# EAGLE design H09R0 (EAGLE 9.6.1)

## Sheet 1 of 2
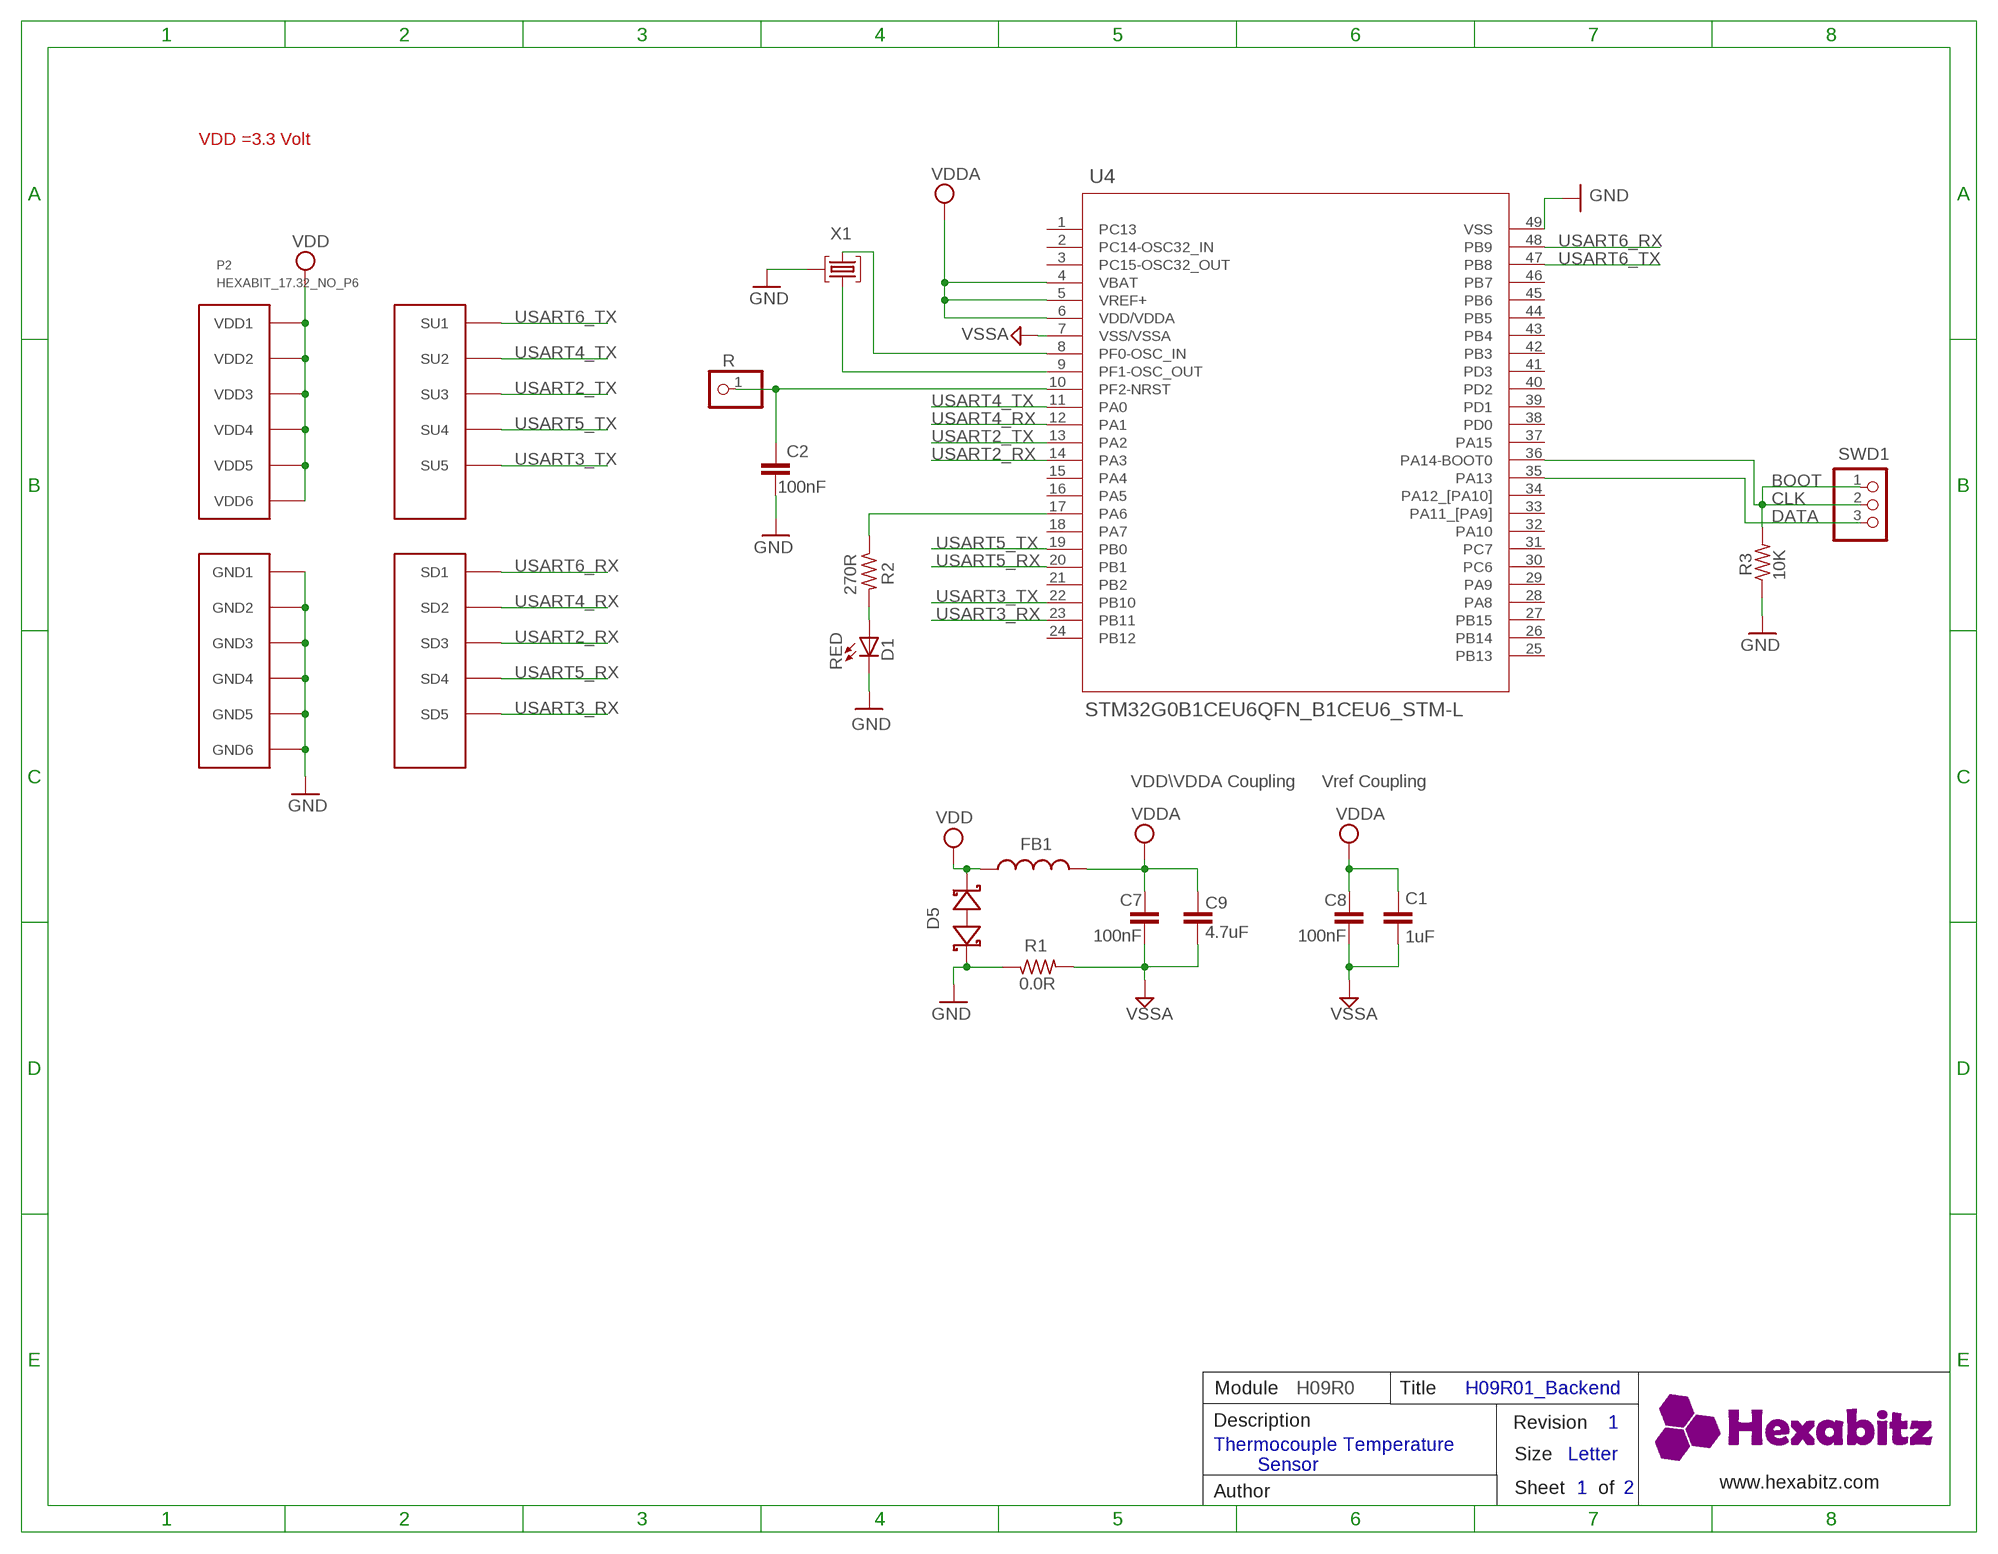
[diagram p0: schematic, sheet 1]

### Parts
C1  1uF  C-0805  [C-0805]
C2  100nF  C-0603  [C-0603]
C7  100nF  C-0603  [C-0603]
C8  100nF  C-0603  [C-0603]
C9  4.7uF  C-0805  [C-0805]
D1  RED  VLMS1300-GS08  [VLMS1300-GS08]
D5  BOURNS_CDSOD323-T03SCBOURNS_CDSOD323-T03SC_0_0  [BOURNS_CDSOD323-T03SC_0]
FB1  FB-TDK_MMZ1608Y300B  FB-0603  [FB-0603]
P2  HEXABIT_17.32_NO_P6  [HEXABIT_17.32_NO_P6]
R  R  PINHD-1X1  [1X01]
R1  0.0R  R-0603  [R-0603]
R2  270R  R-0603  [R-0603]
R3  10K  R-0603  [R-0603]
SWD1  PINHD-1X3  [1X03]
U4  STM32G0B1CEU6QFN_B1CEU6_STM-L  [QFN_B1CEU6_STM-L]
X1  XTALL_CSTCE8M00G52  [XTALL_CSTCE8M00G52]

### Nets
CLK: R3.2 SWD1.1 SWD1.2 U4.36(PA14-BOOT0)
DATA: SWD1.3 U4.35(PA13)
GND: C2.2 D1.C D5.1(A) P2.PAD_PD7(GND1) P2.PAD_PD8(GND2) P2.PAD_PD9(GND3) P2.PAD_PD10(GND4) P2.PAD_PD11(GND5) P2.PAD_PD12(GND6) R1.1 R3.1 U4.49(VSS) X1.P$2 ; also sheet 2
N$8: U4.9(PF1-OSC_OUT) X1.P$1
N$10: U4.8(PF0-OSC_IN) X1.P$3
N$14: C2.1 R.1 U4.10(PF2-NRST)
N$15: R2.1 U4.17(PA6)
N$16: D1.A R2.2
USART2_RX: P2.PAD_PD3(SD3) U4.14(PA3)
USART2_TX: P2.PAD_PU3(SU3) U4.13(PA2)
USART3_RX: P2.PAD_PD5(SD5) U4.23(PB11)
USART3_TX: P2.PAD_PU5(SU5) U4.22(PB10)
USART4_RX: P2.PAD_PD2(SD2) U4.12(PA1)
USART4_TX: P2.PAD_PU2(SU2) U4.11(PA0)
USART5_RX: P2.PAD_PD4(SD4) U4.20(PB1)
USART5_TX: P2.PAD_PU4(SU4) U4.19(PB0)
USART6_RX: P2.PAD_PD1(SD1) U4.48(PB9)
USART6_TX: P2.PAD_PU1(SU1) U4.47(PB8)
VDD: D5.2(C) FB1.2 P2.PAD_PU7(VDD1) P2.PAD_PU8(VDD2) P2.PAD_PU9(VDD3) P2.PAD_PU10(VDD4) P2.PAD_PU11(VDD5) P2.PAD_PU12(VDD6) ; also sheet 2
VDDA: C1.1 C7.1 C8.1 C9.1 FB1.1 U4.4(VBAT) U4.5(VREF+) U4.6(VDD/VDDA)
VSSA: C1.2 C7.2 C8.2 C9.2 R1.2 U4.7(VSS/VSSA)
Unconnected: U4.1(PC13) U4.2(PC14-OSC32_IN) U4.3(PC15-OSC32_OUT) U4.15(PA4) U4.16(PA5) U4.18(PA7) U4.21(PB2) U4.24(PB12) U4.25(PB13) U4.26(PB14) U4.27(PB15) U4.28(PA8) U4.29(PA9) U4.30(PC6) U4.31(PC7) U4.32(PA10) U4.33(PA11_[PA9]) U4.34(PA12_[PA10]) U4.37(PA15) U4.38(PD0) U4.39(PD1) U4.40(PD2) U4.41(PD3) U4.42(PB3) U4.43(PB4) U4.44(PB5) U4.45(PB6) U4.46(PB7)

### Notes on the sheet
- VDD =3.3 Volt
- BOOT
- VDD\VDDA Coupling | Vref Coupling
- Module | H09R0 | Title | H09R01_Backend
- Description | Revision | 1
- Size | Letter
- Thermocouple Temperature 
          Sensor
- 2 | www.hexabitz.com
- Author | Sheet      of | 1
- C:/Users/Admin/Desktop/logodraft.bmp
- C:/Users/Admin/Desktop/logodraft.bmp

## Sheet 2 of 2
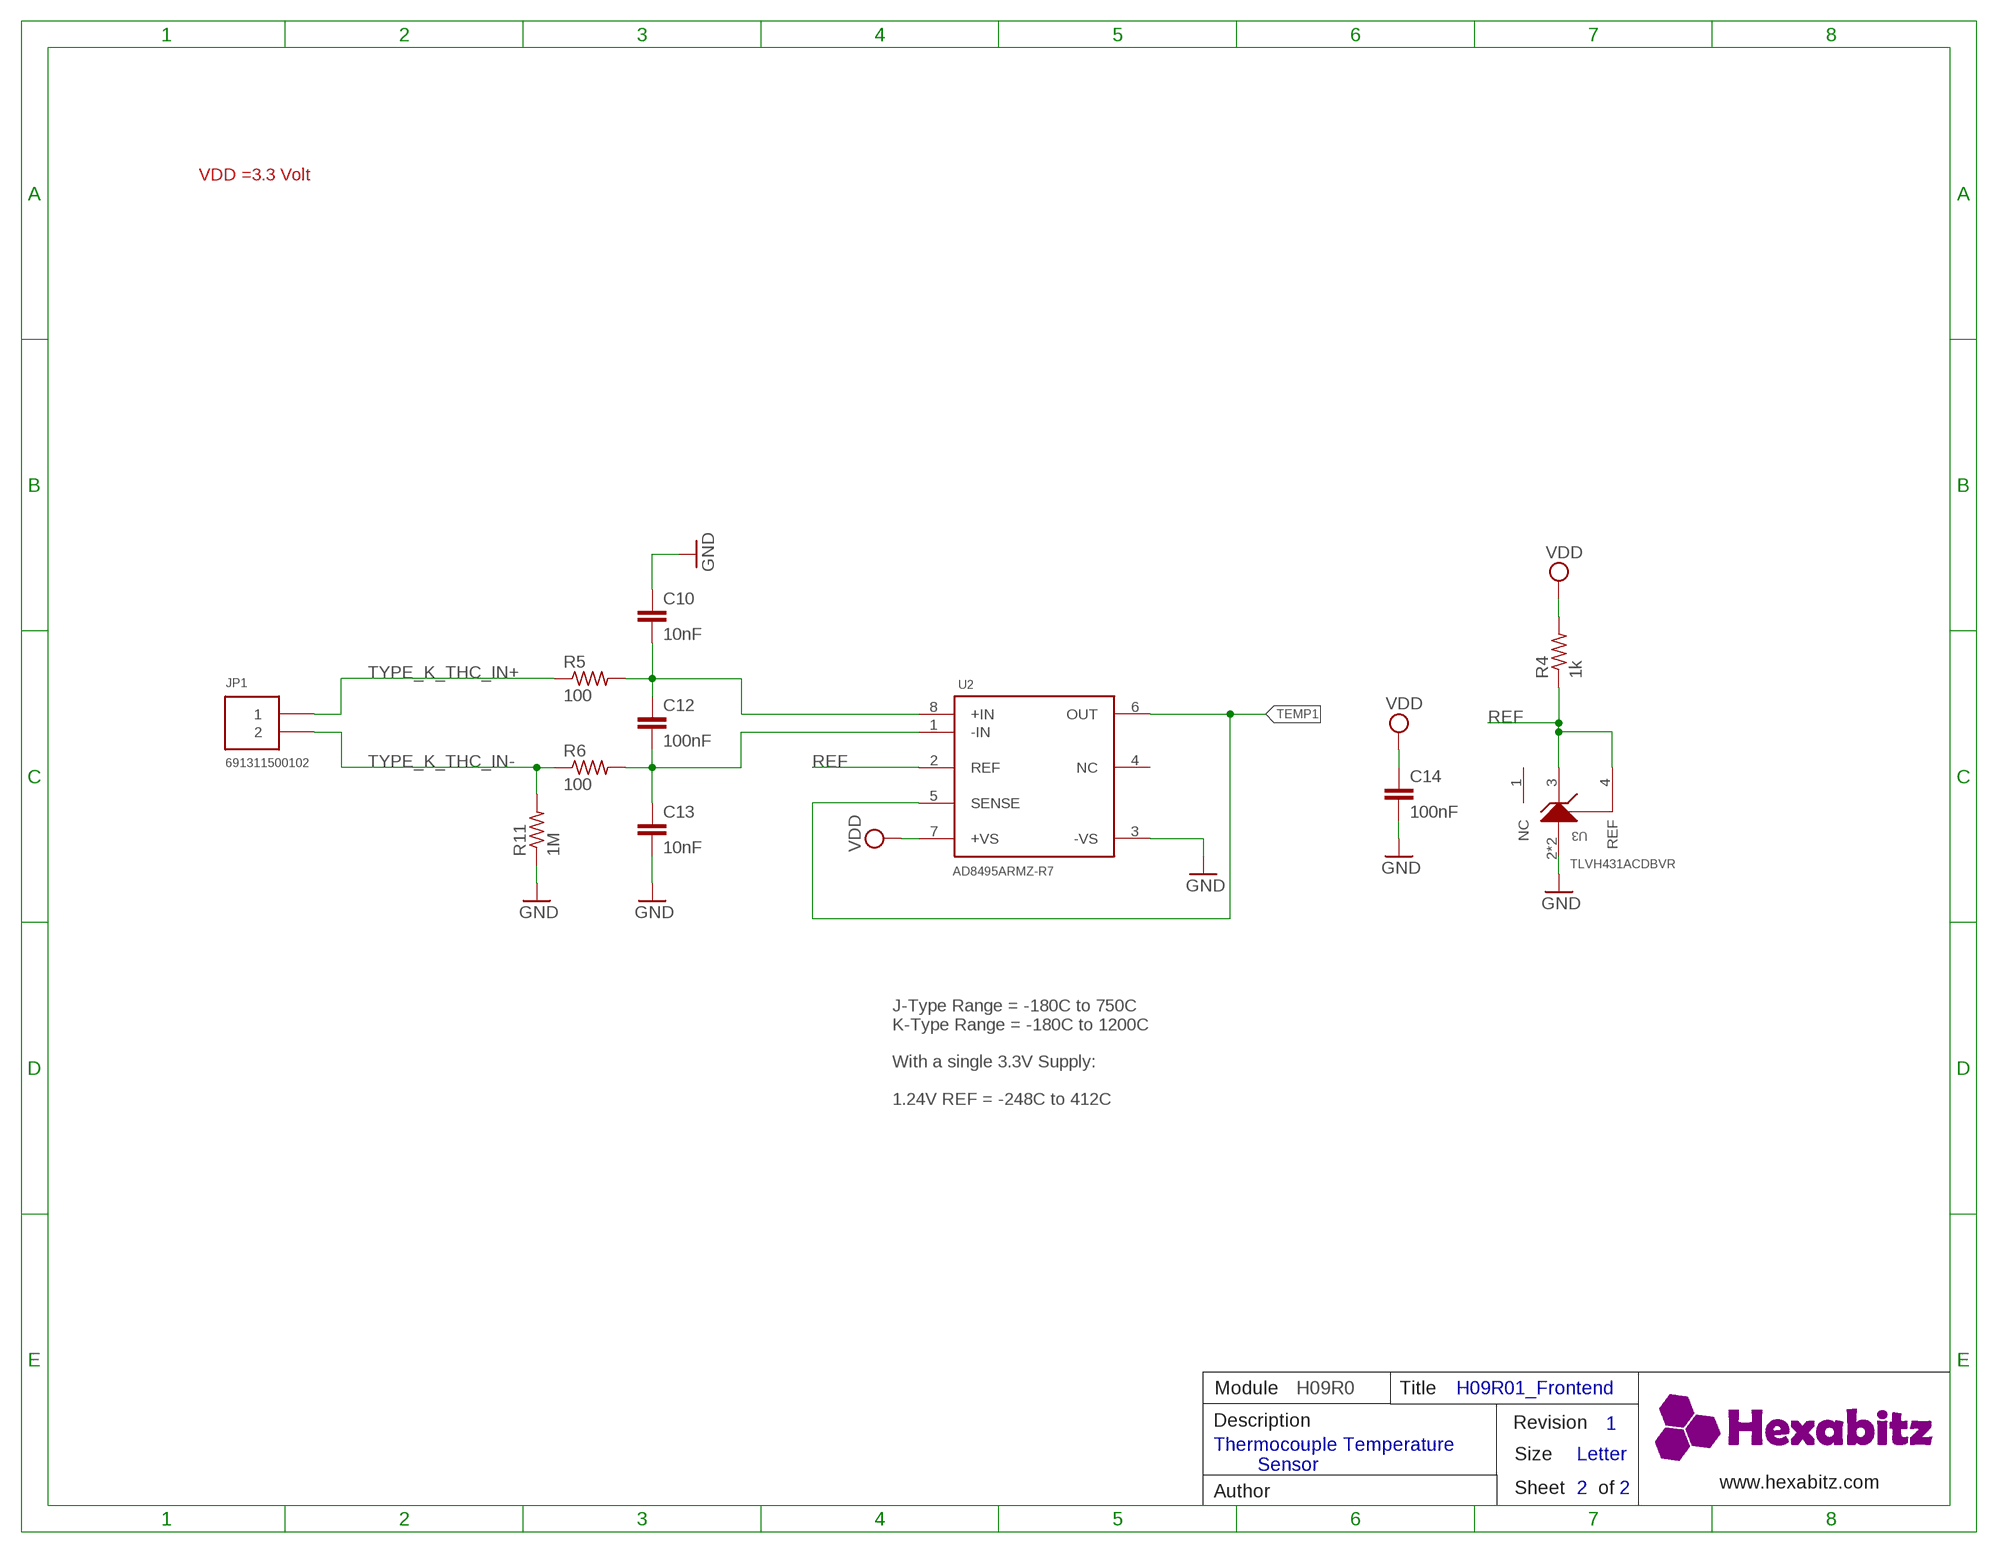
[diagram p1: schematic, sheet 2]

### Parts
C10  10nF  C-0603  [C-0603]
C12  100nF  C-0603  [C-0603]
C13  10nF  C-0603  [C-0603]
C14  100nF  C-0603  [C-0603]
JP1  691311500102  1546111-2  [1546111-2]
R4  1k  R-0402  [R-0402]
R5  100  R-0402  [R-0402]
R6  100  R-0402  [R-0402]
R11  1M  R-0402  [R-0402]
U2  AD8495ARMZ-R7  AD8495ARMZ  [AD8495ARMZ]
U3  TLVH431ACDBVR  [TLVH431ACDBVR]

### Nets
GND: C10.1 C13.2 C14.2 R11.1 U2.3(-VS) U3.2(ANODE) U3.5(ANODE) ; also sheet 1
N$3: C10.2 C12.1 R5.2 U2.8(+IN)
N$7: C12.2 C13.1 R6.2 U2.1(-IN)
REF: R4.1 U2.2(REF) U3.3(CATHODE) U3.4(REF)
TEMP1: U2.5(SENSE) U2.6(OUT)
TYPE_K_THC_IN+: JP1.1 R5.1
TYPE_K_THC_IN-: JP1.2 R6.1 R11.2
VDD: C14.1 R4.2 U2.7(+VS) ; also sheet 1
Unconnected: U2.4(NC) U3.1(NC)

### Notes on the sheet
- VDD =3.3 Volt
- J-Type Range = -180C to 750C
  K-Type Range = -180C to 1200C
  
  With a single 3.3V Supply:
  
  1.24V REF = -248C to 412C
- Module | H09R0 | Title | H09R01_Frontend
- Description | Revision | 1
- Size | Letter
- Thermocouple Temperature 
          Sensor
- www.hexabitz.com
- Author | Sheet      of | 2 | 2
- C:/Users/Admin/Desktop/logodraft.bmp

## Library data of the parts
C1 C9 = HEXABITZ_RCLS:C-0805: CAP CER 10% X7R 0805
C2 C7 C8 = HEXABITZ_RCLS:C-0603: CAP CER 10% X7R 0603
C10 C13 = HEXABITZ_RCLS:C-0603: CAP CER 10% X7R 0603; CAPACITANCE: 10nF; MFN: KEMET; MPN: C0603C103K5RACTU; OCTOPART_URL: https://octopart.com/c0603c103k5ractu-kemet-133094?r=sp&s=R_iPBxLnSmGqhkU2rIMFpg; TOLERANCE: 10%; VOLTAGE_RATING: 50V
C12 C14 = HEXABITZ_RCLS:C-0603: CAP CER 10% X7R 0603; CAPACITANCE: 100nF; MFN: KEMET; MPN: C0603C104K8RACTU; OCTOPART_URL: https://octopart.com/c0603c104k8ractu-kemet-145075?r=sp&s=9bS9ASSwSEqMCE9KBEQZ0g; TOLERANCE: 10%; VOLTAGE_RATING: 10V
D1 = HEXABITZ_USER_INTERFACE_PARTS:VLMS1300-GS08: Red 0603 130° Clear 54 mcd 2 V Surface Mount ChipLED ; Octopart Url : http://octopart.com/vlms1300-gs08-vishay-21709201; MFN: Vishay; MPN: VLMS1300-GS08; OCTOPART_URL: https://octopart.com/vlms1300-gs08-vishay-21709201?r=sp&s=_gcP4_q8T1SC6PJQPTQ9yA
D5 = HEXABITZ_RCLS:BOURNS_CDSOD323-T03SC: CDSOD323-TxxSC - TVS Diode Series; DESCRIPTION: Dio Tvs Vwm 03V 500W Bidir Sod323 / Tape & Reel - 7" Reel; MFN: Bourns; MPN: CDSOD323-T03SC; OCTOPART_URL: https://octopart.com/cdsod323-t03sc-bourns-10487153?r=sp
FB1 = HEXABITZ_RCLS:FB-0603: Ferrite Beads Multi-Layer 0603; MFN: TDK; MPN: MMZ1608Y300B; OCTOPART_URL: https://octopart.com/mmz1608y300b-tdk-368280?r=sp&s=cd9_2ZEqQ9q9UNBuQgHAiA
JP1 = HEXABITZ_CONNECTION_PARTS:1546111-2: Conn Shrouded Header HDR 2 POS 5.08mm Solder ST Thru-Hole; MFN: TE Connectivity; MPN: 1546111-2; OCTOPART_URL: https://octopart.com/1546111-2-te+connectivity-40393355
P2 = hexabitz_connectors:HEXABIT_?_NO_P6: Hexabitz Hexagon Module Connector Hexagon side length = 17.32mm. The following ports are removed: P6
R = HEXABITZ_USER_INTERFACE_PARTS:PINHD-1X1: PIN HEADER; MFN: TE Connectivity; MPN: 87227-1; OCTOPART_URL: https://octopart.com/87227-1-te+connectivity-39512052?r=sp
R1 = HEXABITZ_RCLS:R-0603: Thick Film Resistors - SMD 0603; MFN: Yageo; MPN: RC0603JR-070RL; OCTOPART_URL: https://octopart.com/rc0603jr-070rl-yageo-1241539?r=sp&s=X2NteqRjRNWrnx42Y0aliA; RESISTANCE: 0.0 Ohm
R2 R3 = HEXABITZ_RCLS:R-0603: Thick Film Resistors - SMD 0603
R4 = HEXABITZ_RCLS:R-0402: Thick Film Resistors - SMD 0603; MFN: Yageo; MPN: RC0402FR-071KL; OCTOPART_URL: https://octopart.com/search?q=RC0402FR-071KL&start=0; RESISTANCE: 1k; TOLERANCE: 1%
R5 R6 = HEXABITZ_RCLS:R-0402: Thick Film Resistors - SMD 0603; MFN: Yageo; MPN: RC0402FR-07100RL; OCTOPART_URL: https://octopart.com/search?q=RC0402FR-07100RL&start=0; RESISTANCE: 100; TOLERANCE: 1%
R11 = HEXABITZ_RCLS:R-0402: Thick Film Resistors - SMD 0603; MFN: Yageo; MPN: RC0402FR-071ML; OCTOPART_URL: https://octopart.com/search?q=RC0402FR-071ML&start=0; RESISTANCE: 1M; TOLERANCE: 1%
SWD1 = pinhead:PINHD-1X3: PIN HEADER
U2 = Hexabitz:AD8495ARMZ: Description : IC THERMOCOUPLE A W/COMP 8MSOP; MFG: Analog Devices; MPN: AD8495ARMZ-R7; OCTOPART_URL: https://octopart.com/search?q=AD8495ARMZ-R7&start=0
U3 = Hexabitz:TLVH431ACDBVR: LOW-VOLTAGE ADJUSTABLE PRECISION SHUNT REGULATORS; MFN: Texas Instruments; MPN: TLVH431ACDBVR; OCTOPART_URL: https://octopart.com/search?q=TLVH431ACDBVR&start=0
U4 = HEXABITZ_ICs:STM32G0B1CEU6; COPYRIGHT: Copyright (C) 2021 Ultra Librarian. All rights reserved.; MANUFACTURER_PART_NUMBER: STM32G0B1CEU6; MFR_NAME: STMicroelectronics; SPICEPREFIX: X
X1 = HEXABITZ_RCLS:XTALL_CSTCE8M00G52: MURATA CSTCE8M00G52-R0 RESONATOR, SMD, 8MHZ ; Octopart Url : https://octopart.com/cstce8m00g52-r0-murata-7145559; MFN: Murata; MPN: CSTCE8M00G52Z-R0; OCTOPART_URL: https://octopart.com/cstce8m00g52z-r0-murata-17755941?r=sp&s=JDnNJnrHQhyS8Zk4ofFWXw

## Board
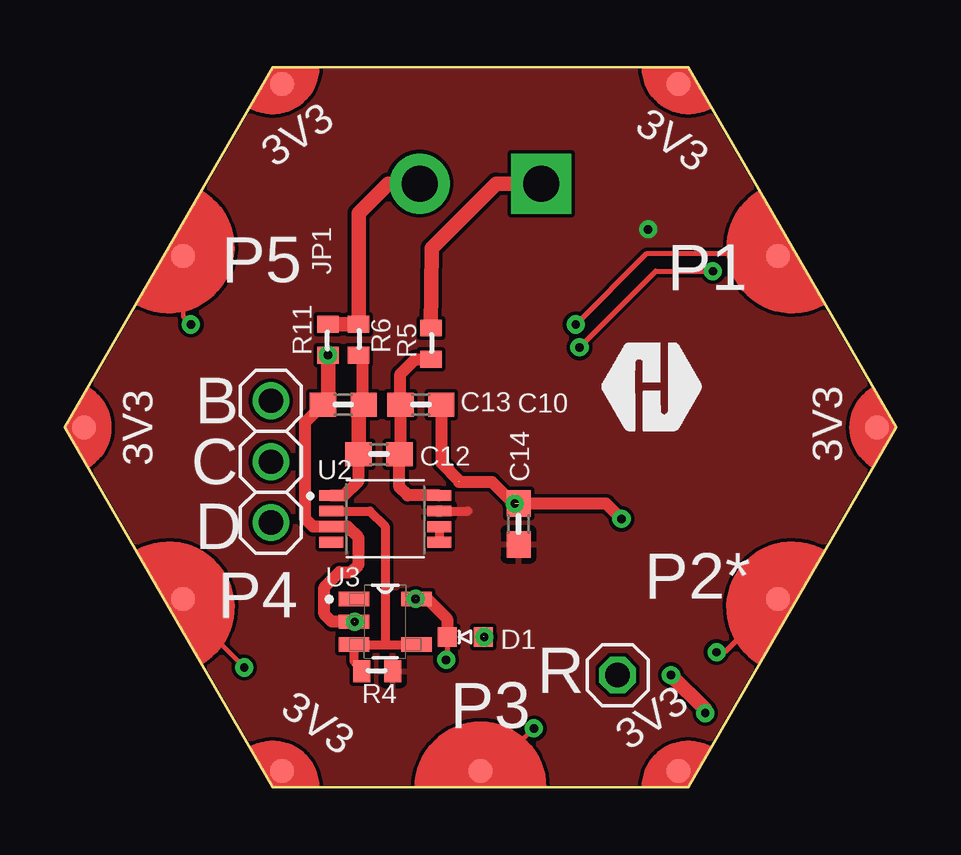
[diagram p2: board, top side]
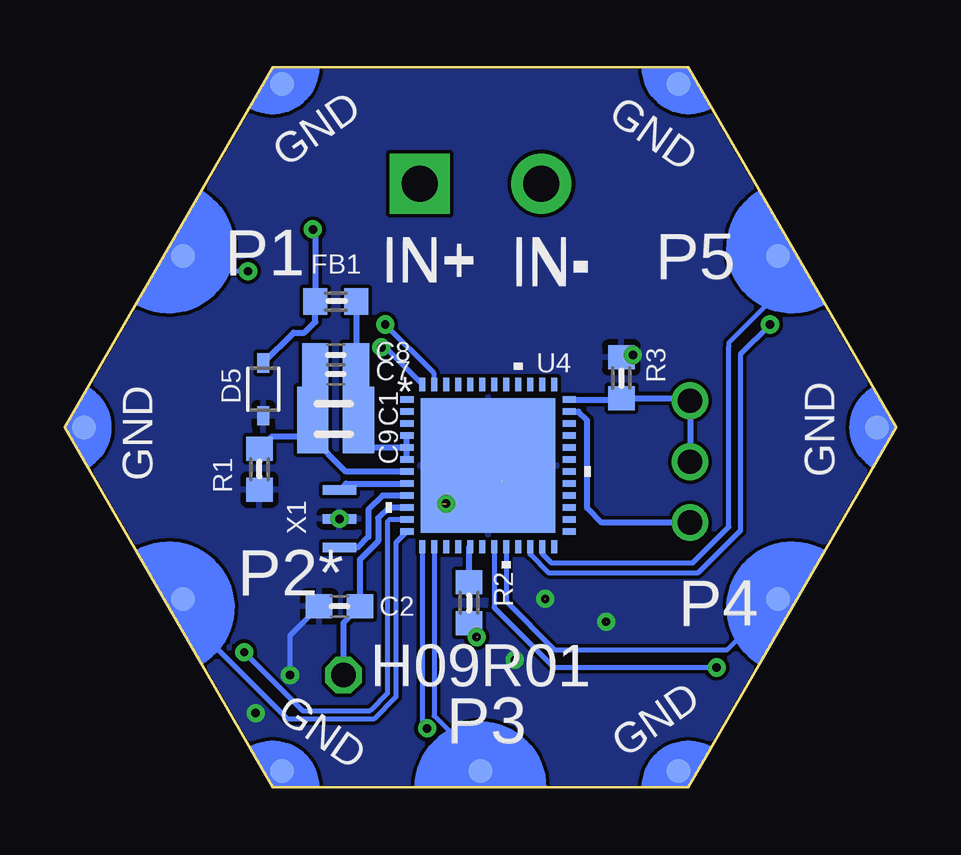
[diagram p3: board, bottom side, seen from below]

Size 34.64 x 30 mm. Coordinates in mm from the lower left corner, seen from the top.
Copper layers (1*16): Top 0.035mm / dielectric 1.5mm / Bottom 0.035mm
Design rules "default *": minimum track width 7mil, minimum drill 10mil, track to track 6mil, track to pad 6mil, pad to pad 6mil, via to via 6mil, smd to smd 0mil, copper to edge 1mil, drill to drill 8mil, minimum pad ring 10mil, minimum via ring 8mil, stop-mask expansion 2mil, vias tented up to drill 15mil, thermal gap 10mil

### Footprints (pad centres in the part's own frame; a part is rotated, then mirrored left to right if it is on the bottom)
C-0805 = smd 1.3 x 1.5: 1 -0.95,0; 2 0.95,0
C-0603 = smd 1.1 x 1: 1 -0.85,0; 2 0.85,0
VLMS1300-GS08 = smd 0.8 x 0.8: A 0,0.75; C 0,-0.75
BOURNS_CDSOD323-T03SC_0 = smd 0.8 x 0.5: 1 -1.1,0; 2 1.1,0
FB-0603 = smd 1 x 1.1: 1 -0.85,0; 2 0.85,0
1546111-2 = drill 1.5 pad 2.5 square: 1 -2.54,0 | drill 1.5 pad 2.5: 2 2.54,0
HEXABIT_17.32_NO_P6 = smd 1 x 1 bottom: PAD_PD1 12.39,7.15; PAD_PD2 12.39,-7.15; PAD_PD3 0,-14.31; PAD_PD4 -12.39,-7.15; PAD_PD5 -12.39,7.15; PAD_PD7 8.26,14.31; PAD_PD8 16.52,0; PAD_PD9 8.26,-14.31; PAD_PD10 -8.26,-14.31; PAD_PD11 -16.52,0; PAD_PD12 -8.26,14.31 | smd 1 x 1: PAD_PU1 12.39,7.15; PAD_PU2 12.39,-7.15; PAD_PU3 0,-14.31; PAD_PU4 -12.39,-7.15; PAD_PU5 -12.39,7.15; PAD_PU7 8.26,14.31; PAD_PU8 16.52,0; PAD_PU9 8.26,-14.31; PAD_PU10 -8.26,-14.31; PAD_PU11 -16.52,0; PAD_PU12 -8.26,14.31
1X01 = drill 1.016 octagon: 1 0,0
R-0603 = smd 1 x 1.1: 1 -0.85,0; 2 0.85,0
R-0402 = smd 0.7 x 0.9: 1 -0.65,0; 2 0.65,0
1X03 = drill 1.016: 1 -2.54,0; 2 0,0; 3 2.54,0
AD8495ARMZ = smd 0.45 x 1: 1 -0.975,-2.244; 2 -0.325,-2.244; 3 0.325,-2.244; 4 0.975,-2.244; 5 0.975,2.244; 6 0.325,2.244; 7 -0.325,2.244; 8 -0.975,2.244
TLVH431ACDBVR = smd 1.27 x 0.6: 1 -1.3,0.95; 2 -1.3,0; 3 -1.3,-0.95; 4 1.3,-0.95; 5 1.3,0.95
QFN_B1CEU6_STM-L = smd 0.55 x 0.254: 1 -3.38,2.751; 2 -3.38,2.251; 3 -3.38,1.75; 4 -3.38,1.25; 5 -3.38,0.75; 6 -3.38,0.25; 7 -3.38,-0.25; 8 -3.38,-0.75; 9 -3.38,-1.25; 10 -3.38,-1.75; 11 -3.38,-2.251; 12 -3.38,-2.751; 25 3.38,-2.751; 26 3.38,-2.251; 27 3.38,-1.75; 28 3.38,-1.25; 29 3.38,-0.75; 30 3.38,-0.25; 31 3.38,0.25; 32 3.38,0.75; 33 3.38,1.25; 34 3.38,1.75; 35 3.38,2.251; 36 3.38,2.751 | smd 0.254 x 0.55: 13 -2.751,-3.38; 14 -2.251,-3.38; 15 -1.75,-3.38; 16 -1.25,-3.38; 17 -0.75,-3.38; 18 -0.25,-3.38; 19 0.25,-3.38; 20 0.75,-3.38; 21 1.25,-3.38; 22 1.75,-3.38; 23 2.251,-3.38; 24 2.751,-3.38; 37 2.751,3.38; 38 2.251,3.38; 39 1.75,3.38; 40 1.25,3.38; 41 0.75,3.38; 42 0.25,3.38; 43 -0.25,3.38; 44 -0.75,3.38; 45 -1.25,3.38; 46 -1.75,3.38; 47 -2.251,3.38; 48 -2.751,3.38 | smd 5.6 x 5.6: 49 0,0
XTALL_CSTCE8M00G52 = smd 1.4 x 0.4: P$1 0,1.2; P$2 0,0; P$3 0,-1.2

### Placement (x,y rotation side)
C1  23.35,15.95 180 bottom
C2  23.19,7.54 180 bottom
C7  23.35,17.22 180 bottom
C8  23.35,18.02 180 bottom
C9  23.35,14.68 180 bottom
C10  14.84,15.95 180 top
C12  13.09,13.89 180 top
C13  11.6,15.95 180 top
C14  18.91,10.98 90 top
D1  16.68,6.27 270 top
D5  26.37,16.59 90 bottom
FB1  23.35,20.24 180 bottom
JP1  17.32,25.16 180 top
P2  17.32,15 0 top
R  23.04,4.68 0 top
R1  26.53,13.25 90 bottom
R2  17.8,7.7 270 bottom
R3  11.45,17.06 270 bottom
R4  13.02,4.84 0 top
R5  15.26,18.49 270 top
R6  12.24,18.65 270 top
R11  10.97,18.65 90 top
SWD1  8.59,13.57 270 top
U2  13.35,11.19 270 top
U3  13.35,6.9 0 top
U4  17,13.41 0 bottom
U$1  [HEXA-LOGO]  24.46,14.84 0 top
X1  23.19,11.19 180 bottom

### Tracks (layer width: path | path; a pad name or v marks a point on that pad's centre or on a via)
CLK
  Bottom 0.254: SWD1.2 SWD1.1 8.69,16.21 R3.2 11.5,16.16 U4.36
DATA
  Bottom 0.254: SWD1.3 12.26,11.03 12.88,11.65 12.88,15.3 13.24,15.66 U4.35
GND  (via drill 0.35)  (5 unrouted)
  Top 0.203: D1.C 15.94,5.36 v15.89,5.32
  Top 0.508: 16.42,12.73 17.8,12.73 18.7,11.83 C14.2 22.56,11.83 X1.P$2 | C13.2 10.02,15.22 10.02,11.19 10.34,10.86 U2.3 11.77,10.86 12.24,10.4 12.24,9.28 11.92,8.97 11.45,8.97 10.81,8.33 10.81,7.22 11.13,6.9 U3.2 | U3.5 15.1,7.85 15.94,7.02 D1.C | C10.1 15.69,13.52 16.42,12.78
  Top 0.61: v25.26,4.68 26.69,3.25 v26.69,3.09 | R11.1 10.97,16.17 C13.2
  Bottom 0.203: C2.2 25.26,6.32 v25.26,4.68
  Bottom 0.61: v18.75,11.83 18.59,11.83 U4.49
  other vias: 12.08,6.9 14.62,7.86 23.19,11.19 10.97,18.02
  pour Bottom: 0.06,15.08 8.7,30.06 25.97,30.06 34.61,15.08 25.97,0.09 8.7,0.09
N$3
  Top 0.508: U2.8 14.28,12.17 13.94,12.51 C12.1 | R5.2 14.61,17.84 13.99,17.22 C10.2 13.99,13.93
  Top 0.61: C12.1 13.99,13.93
N$7
  Top 0.508: 12.34,15.79 12.39,15.83 12.39,15.89 | 12.39,15.89 C13.1 | R6.2 12.39,17.76 12.39,15.89 | U2.1 11.63,12.17 12.24,12.78 C12.2
  Top 0.61: C13.1 12.24,15.74 C12.2
N$8
  Bottom 0.254: U4.9 21.41,12.16 21.99,11.58 21.99,10.44 22.44,9.99 X1.P$1
N$10
  Bottom 0.254: X1.P$3 22.92,12.66 U4.8
N$14
  Bottom 0.254: U4.10 21.15,11.66 21.58,11.23 21.58,10.26 22.34,9.49 C2.1 23.04,6.85 R.1
N$15
  Bottom 0.254: R2.1 17.8,9.99 U4.17
N$16  (via drill 0.35)  (1 unrouted)
  Bottom 0.203: R2.2 17.8,6.61 17.48,6.29 v17.48,6.27
REF
  Top 0.381: 13.35,5.95 U3.3 12.05,5.26 R4.1 | 13.35,5.95 U3.4 | U2.2 12.71,11.52 13.35,10.87 13.35,5.95
TEMP1
  Top 0.381: U2.6 U2.5
TYPE_K_THC_IN+
  Top 0.61: R5.1 15.28,22.47 17.97,25.16 JP1.1
TYPE_K_THC_IN-
  Top 0.61: JP1.2 13.47,25.16 12.24,23.93 R6.1 R11.2
USART2_RX
  Bottom 0.178: 19.25,2.98 17.62,1.35 17.32,1.35 P2.PAD_PD3
  Bottom 0.203: U4.14 19.25,2.98
USART2_TX  (via drill 0.35)
  Top 0.178: v19.54,2.46 17.77,0.69 P2.PAD_PU3
  Bottom 0.203: U4.13 19.75,2.67 v19.54,2.46
USART3_RX
  Bottom 0.178: 6.97,18.39 6.97,18.53 4.93,20.56 P2.PAD_PD5
  Bottom 0.203: U4.23 14.75,9.74 14.37,9.35 8.47,9.35 6.97,10.86 6.97,18.39
USART3_TX  (via drill 0.35)
  Top 0.178: v5.26,19.29 4.93,19.61 P2.PAD_PU5
  Bottom 0.203: U4.22 15.25,9.71 14.49,8.95 8.24,8.95 6.49,10.69 6.49,18.05 v5.26,19.29
USART4_RX
  Bottom 0.203: U4.12 20.84,10.2 20.84,3.77 21.77,2.85 25.35,2.85 29.71,7.2 P2.PAD_PD2
USART4_TX  (via drill 0.35)
  Top 0.203: v27.16,5.63 27.49,5.63 P2.PAD_PU2
  Bottom 0.203: U4.11 21.11,11.16 21.2,11.07 21.2,3.92 21.92,3.2 24.73,3.2 v27.16,5.63
USART5_RX
  Bottom 0.178: 7.04,5.74 P2.PAD_PD4
  Bottom 0.203: U4.20 16.25,7.75 14.24,5.74 7.04,5.74
USART5_TX  (via drill 0.35)
  Top 0.178: v7.48,5 4.93,7.55 P2.PAD_PU4
  Bottom 0.203: U4.19 16.75,7.49 14.26,5 v7.48,5
USART6_RX  (via drill 0.35)
  Top 0.203: v27,21.51 24.62,21.51 v21.45,18.33
  Bottom 0.203: U4.48 21.29,18.33 v21.45,18.33 | v27,21.51 29.07,21.51 P2.PAD_PD1
USART6_TX  (via drill 0.35)
  Top 0.203: v21.29,19.29 24.25,22.25 29.61,22.25 P2.PAD_PU1
  Bottom 0.203: U4.47 19.25,17.25 v21.29,19.29
VDD  (via drill 0.35)
  Top 0.381: U2.7 16.8,11.52
  Bottom 0.254: D5.2 25.11,18.95 24.65,18.95 24.2,19.4 FB1.2 24.2,23.15 v24.31,23.25
  pour Top: 8.7,30.06 0.06,15.08 8.7,0.09 25.97,0.09 34.61,15.08 25.97,30.06
VDDA
  Bottom 0.254: U4.6 U4.5 | U4.5 U4.4 | U4.5 21.88,14.16 C9.1 C1.1 22.4,17.12 C7.1 C8.1 FB1.1
VSSA
  Bottom 0.254: C8.2 C7.2 24.3,17.12 C1.2 C9.2 24.45,14.68 24.4,14.63 | R1.2 26,14.63 24.4,14.63 | U4.7 22.93,13.16 24.4,14.63

### Text on the board
tNames: 3V3 | 3V3 | P5 | P1 | B | 3V3 | C | 3V3 | D | P2* | P4 | 3V3 | P3 | 3V3
bNames: GND | GND | P5 | P1 | IN- | IN- | IN- | IN+ | IN+ | IN+ | IN+ | GND | GND | P2* | P4 | H09R01 | GND | P3 | GND